# Altium schematic sheet 串口板.SchDoc
size A4
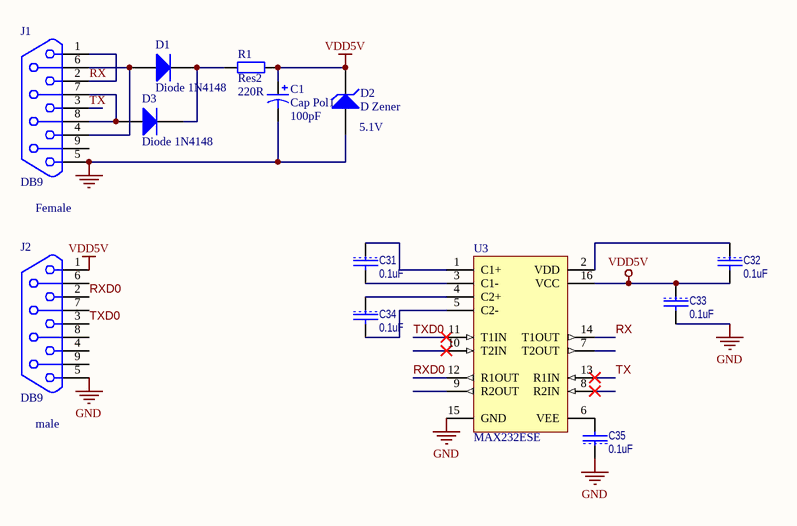
[diagram p0: 串口板.SchDoc]

## Parts
C1  Cap Pol1  value 100pF  [C1206]
C31  0.1uF  [1608[0603]]
C32  0.1uF  [1608[0603]]
C33  0.1uF  [1608[0603]]
C34  0.1uF  [1608[0603]]
C35  0.1uF  [1608[0603]]
D1  Diode 1N4148  [425]
D2  D Zener  value 5.1V  [425]
D3  Diode 1N4148  [425]
J1  DB9  [DB9BSM]
J2  DB9  [DB9BSM]
R1  Res2  value 220R  [1608[0603]]
U3  MAX232ESE  [SOIC16_N]

## Nets
GND: C1.2 C33.2 C35.1 D2.1(A) J1.5 J2.5 U3.15(GND)
VDD5V: C1.1 C32.2 C33.1 D2.2(K) J2.1 R1.2 U3.16(VCC)
RX: J1.1 J1.2 U3.14(T1OUT)
RXD0: J2.2 U3.12(R1OUT)
TX: J1.3 U3.13(R1IN)
TXD0: J2.3 U3.11(T1IN)
NetC31_1: C31.1 U3.1(C1+)
NetC31_2: C31.2 U3.3(C1-)
NetC32_1: C32.1 U3.2(VDD)
NetC34_1: C34.1 U3.4(C2+)
NetC34_2: C34.2 U3.5(C2-)
NetC35_2: C35.2 U3.6(VEE)
NetD1_1: D1.1(A) J1.4 J1.6
NetD1_2: D1.2(K) D3.2(K) R1.1
NetD3_1: D3.1(A) J1.7 J1.8

Not connected (* = marked no-connect by the designer): J1 9; J2 4 6 7 8 9; U3 7(T2OUT) 8(R2IN)* 9(R2OUT) 10(T2IN)*

## Notes on the sheet
- Female
- (near J2) male

## Library data of the parts
C1 = Cap Pol1: Polarized Capacitor (Radial); Published: 8-Jun-2000; LatestRevisionDate: 17-Jul-2002; LatestRevisionNote: Re-released for DXP Platform.; PackageReference: RB7.6-15; Publisher: Altium Limited; PackageDescription: Polarized Capacitor (Radial); 2 Leads
C31-C35 = CAP: Capacitor
D1 D3 = Diode 1N4148: High Conductance Fast Diode; Published: 8-Jun-2000; LatestRevisionDate: 17-Jul-2002; LatestRevisionNote: Re-released for DXP Platform.; DatasheetVersion: 1997; PackageReference: DO-35; Publisher: Altium Limited; PackageDescription: Diode, Axial; Body 3.8 x 1.9 mm (LxDia. max), Lead Dia. 0.53 mm (max); Code_JEDEC: DO-204-AH; ComponentLink1Description: Manufacturer Link; ComponentLink1URL: http://www.fairchildsemi.com/; ComponentLink2Description: Datasheet; ComponentLink2URL: http://www.fairchildsemi.com/ds/1N%2F1N4148.pdf
D2 = D Zener: Zener Diode; Published: 8-Jun-2000; LatestRevisionDate: 17-Jul-2002; LatestRevisionNote: Re-released for DXP Platform.; PackageReference: DIODE-0.7; Publisher: Altium Limited; PackageDescription: Diode, Thru-Hole; 2 Leads; 0.7 in Pin Spacing
R1 = Res2: Resistor; Published: 8-Jun-2000; LatestRevisionDate: 17-Jul-2002; LatestRevisionNote: Re-released for DXP Platform.; PackageReference: AXIAL-0.4; Publisher: Altium Limited; PackageDescription: Axial Device, Thru-Hole; 2 Leads; 0.4 in Pin Spacing
U3 = MAX232ESE: +5V Powered, Multi-Channel RS-232 Driver/Receiver; Published: 16-Jan-2001; LatestRevisionDate: 13-Apr-2006; LatestRevisionNote: IPC-7351 Footprint Added.; PackageReference: NSO16; Publisher: Altium Limited; PackageDescription: 16-Pin Small Outline Integrated Circuit 1.27 mm Pitch; Code_JEDEC: MS-012-AC; Code_IPC: SOIC127P600-16; ComponentLink1Description: Manufacturer Link; ComponentLink1URL: http://www.maxim-ic.com/; ComponentLink2Description: Datasheet; ComponentLink2URL: http://pdfserv.maxim-ic.com/en/ds/MAX220-MAX249.pdf; Supplier 1: Digi-Key; Supplier Part Number 1: MAX232ESE+T-ND